# EAGLE schematic ESC_BOARD_NEW (EAGLE 8.5.0)
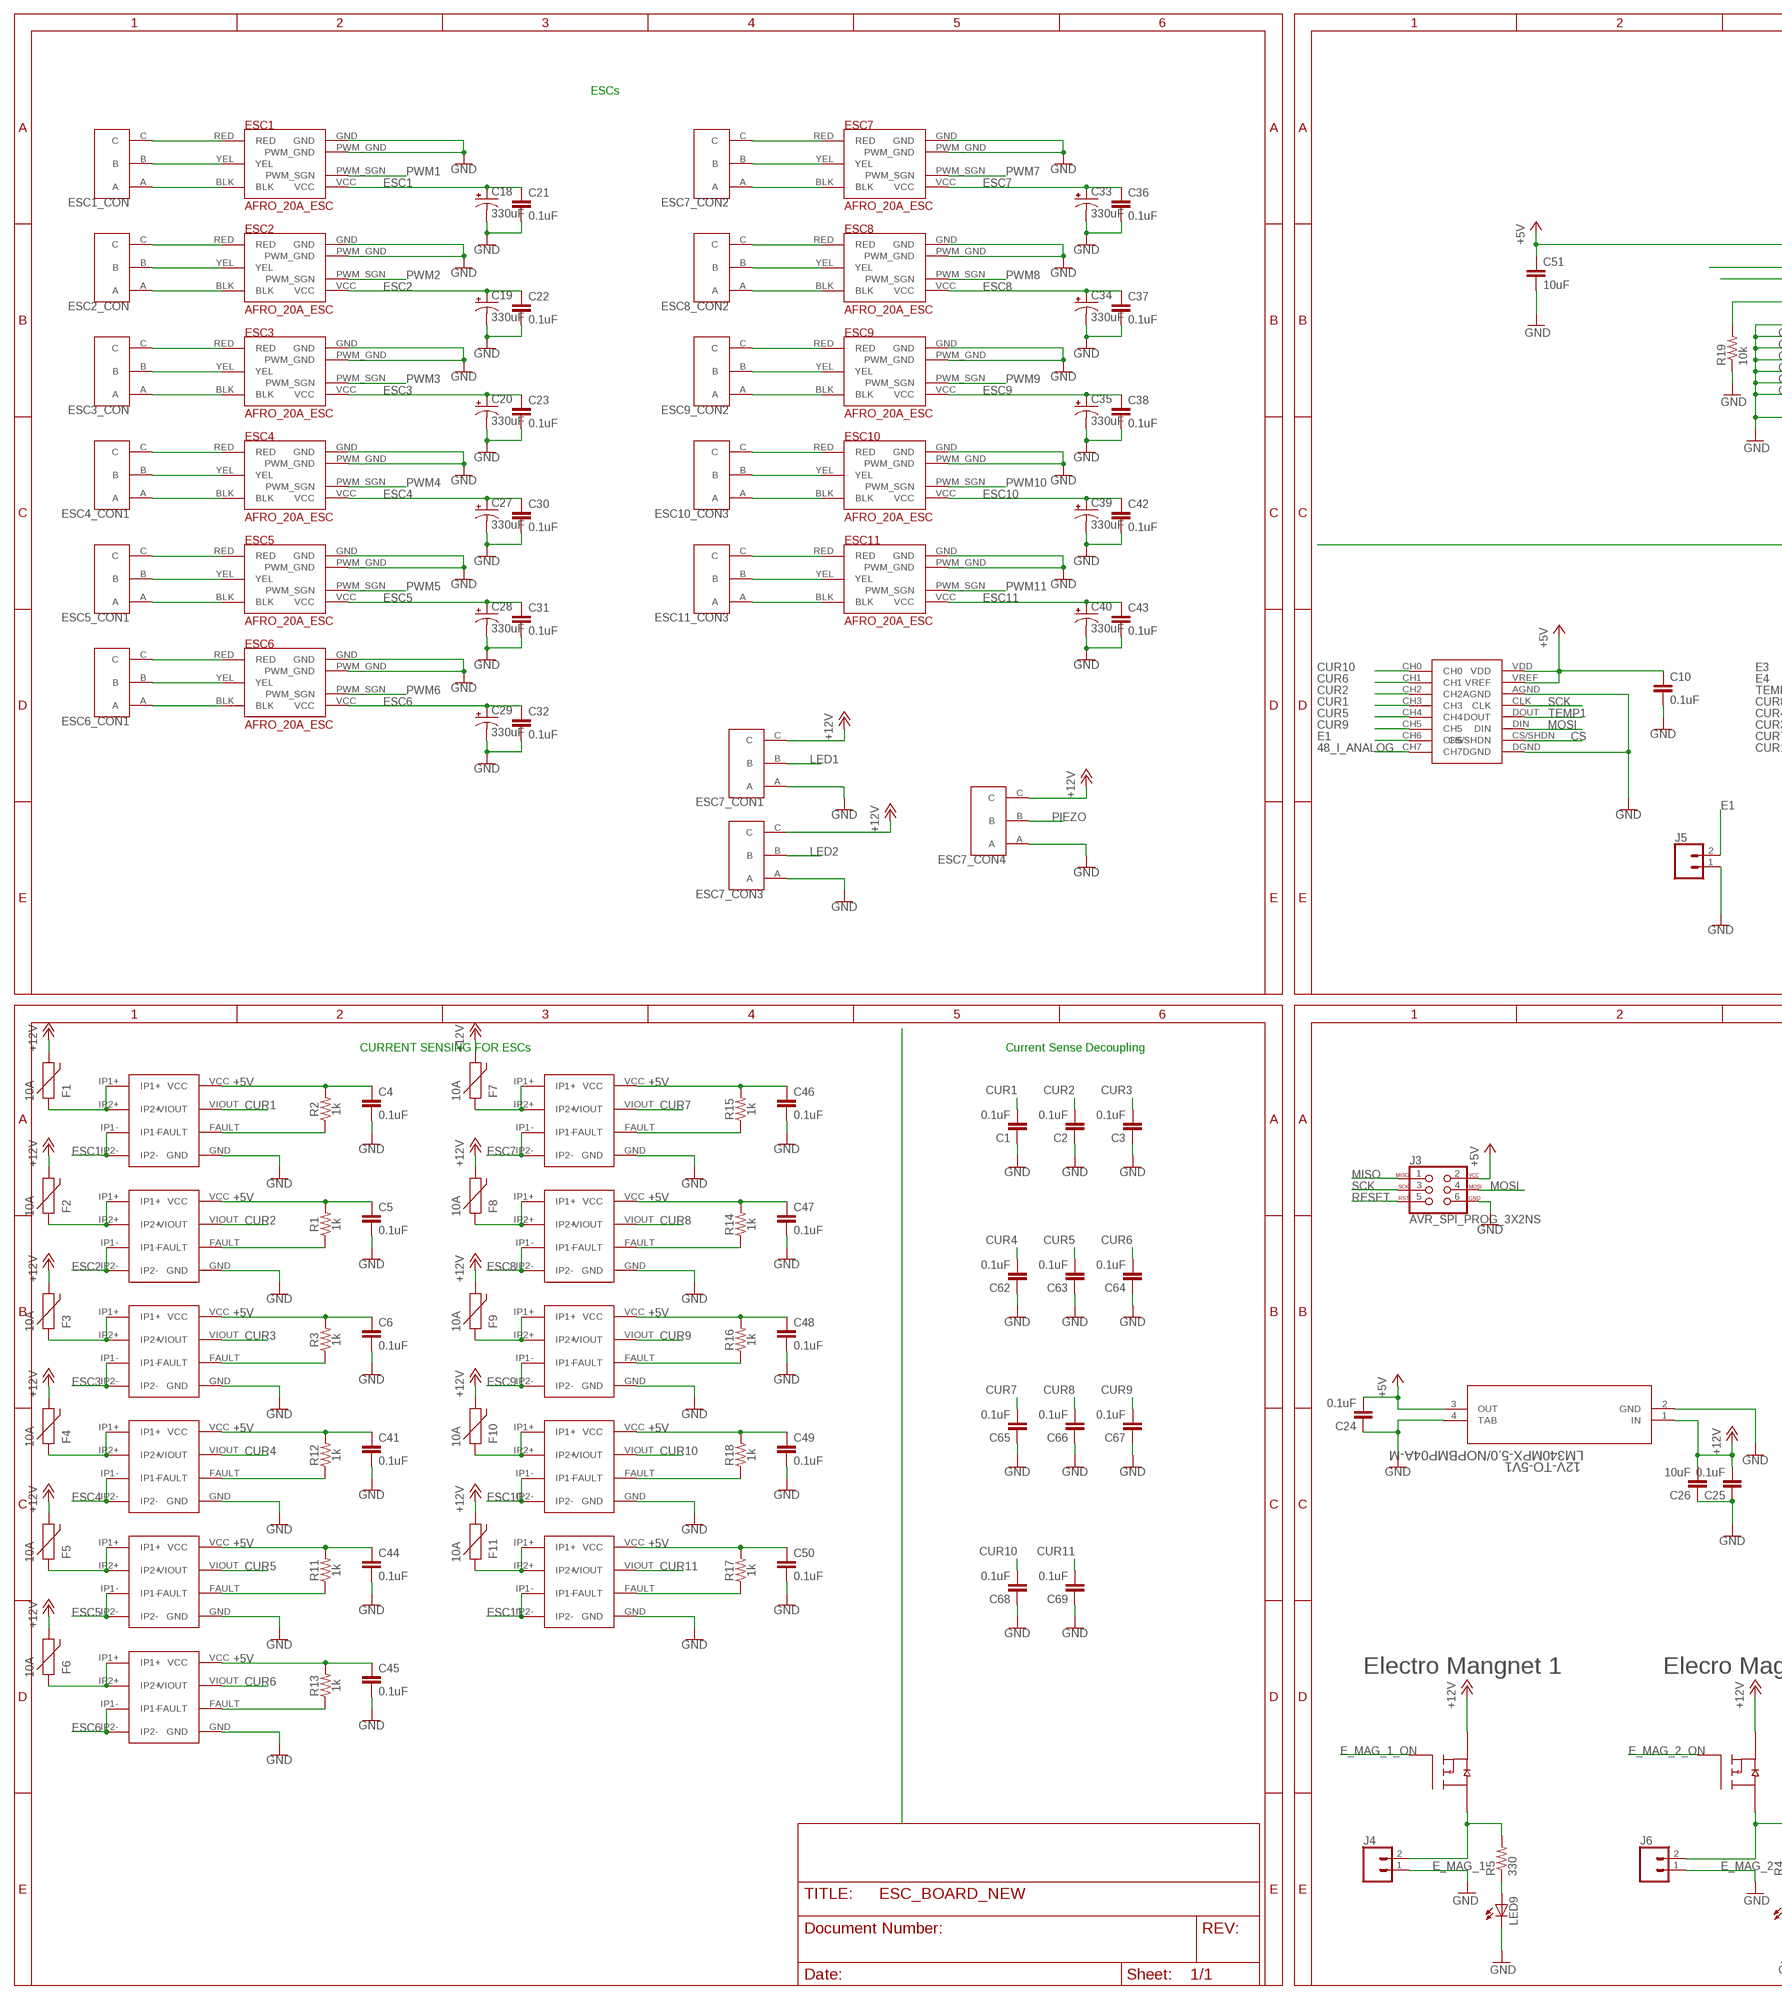
[diagram p0: schematic, sheet 1, part 1 of 2]
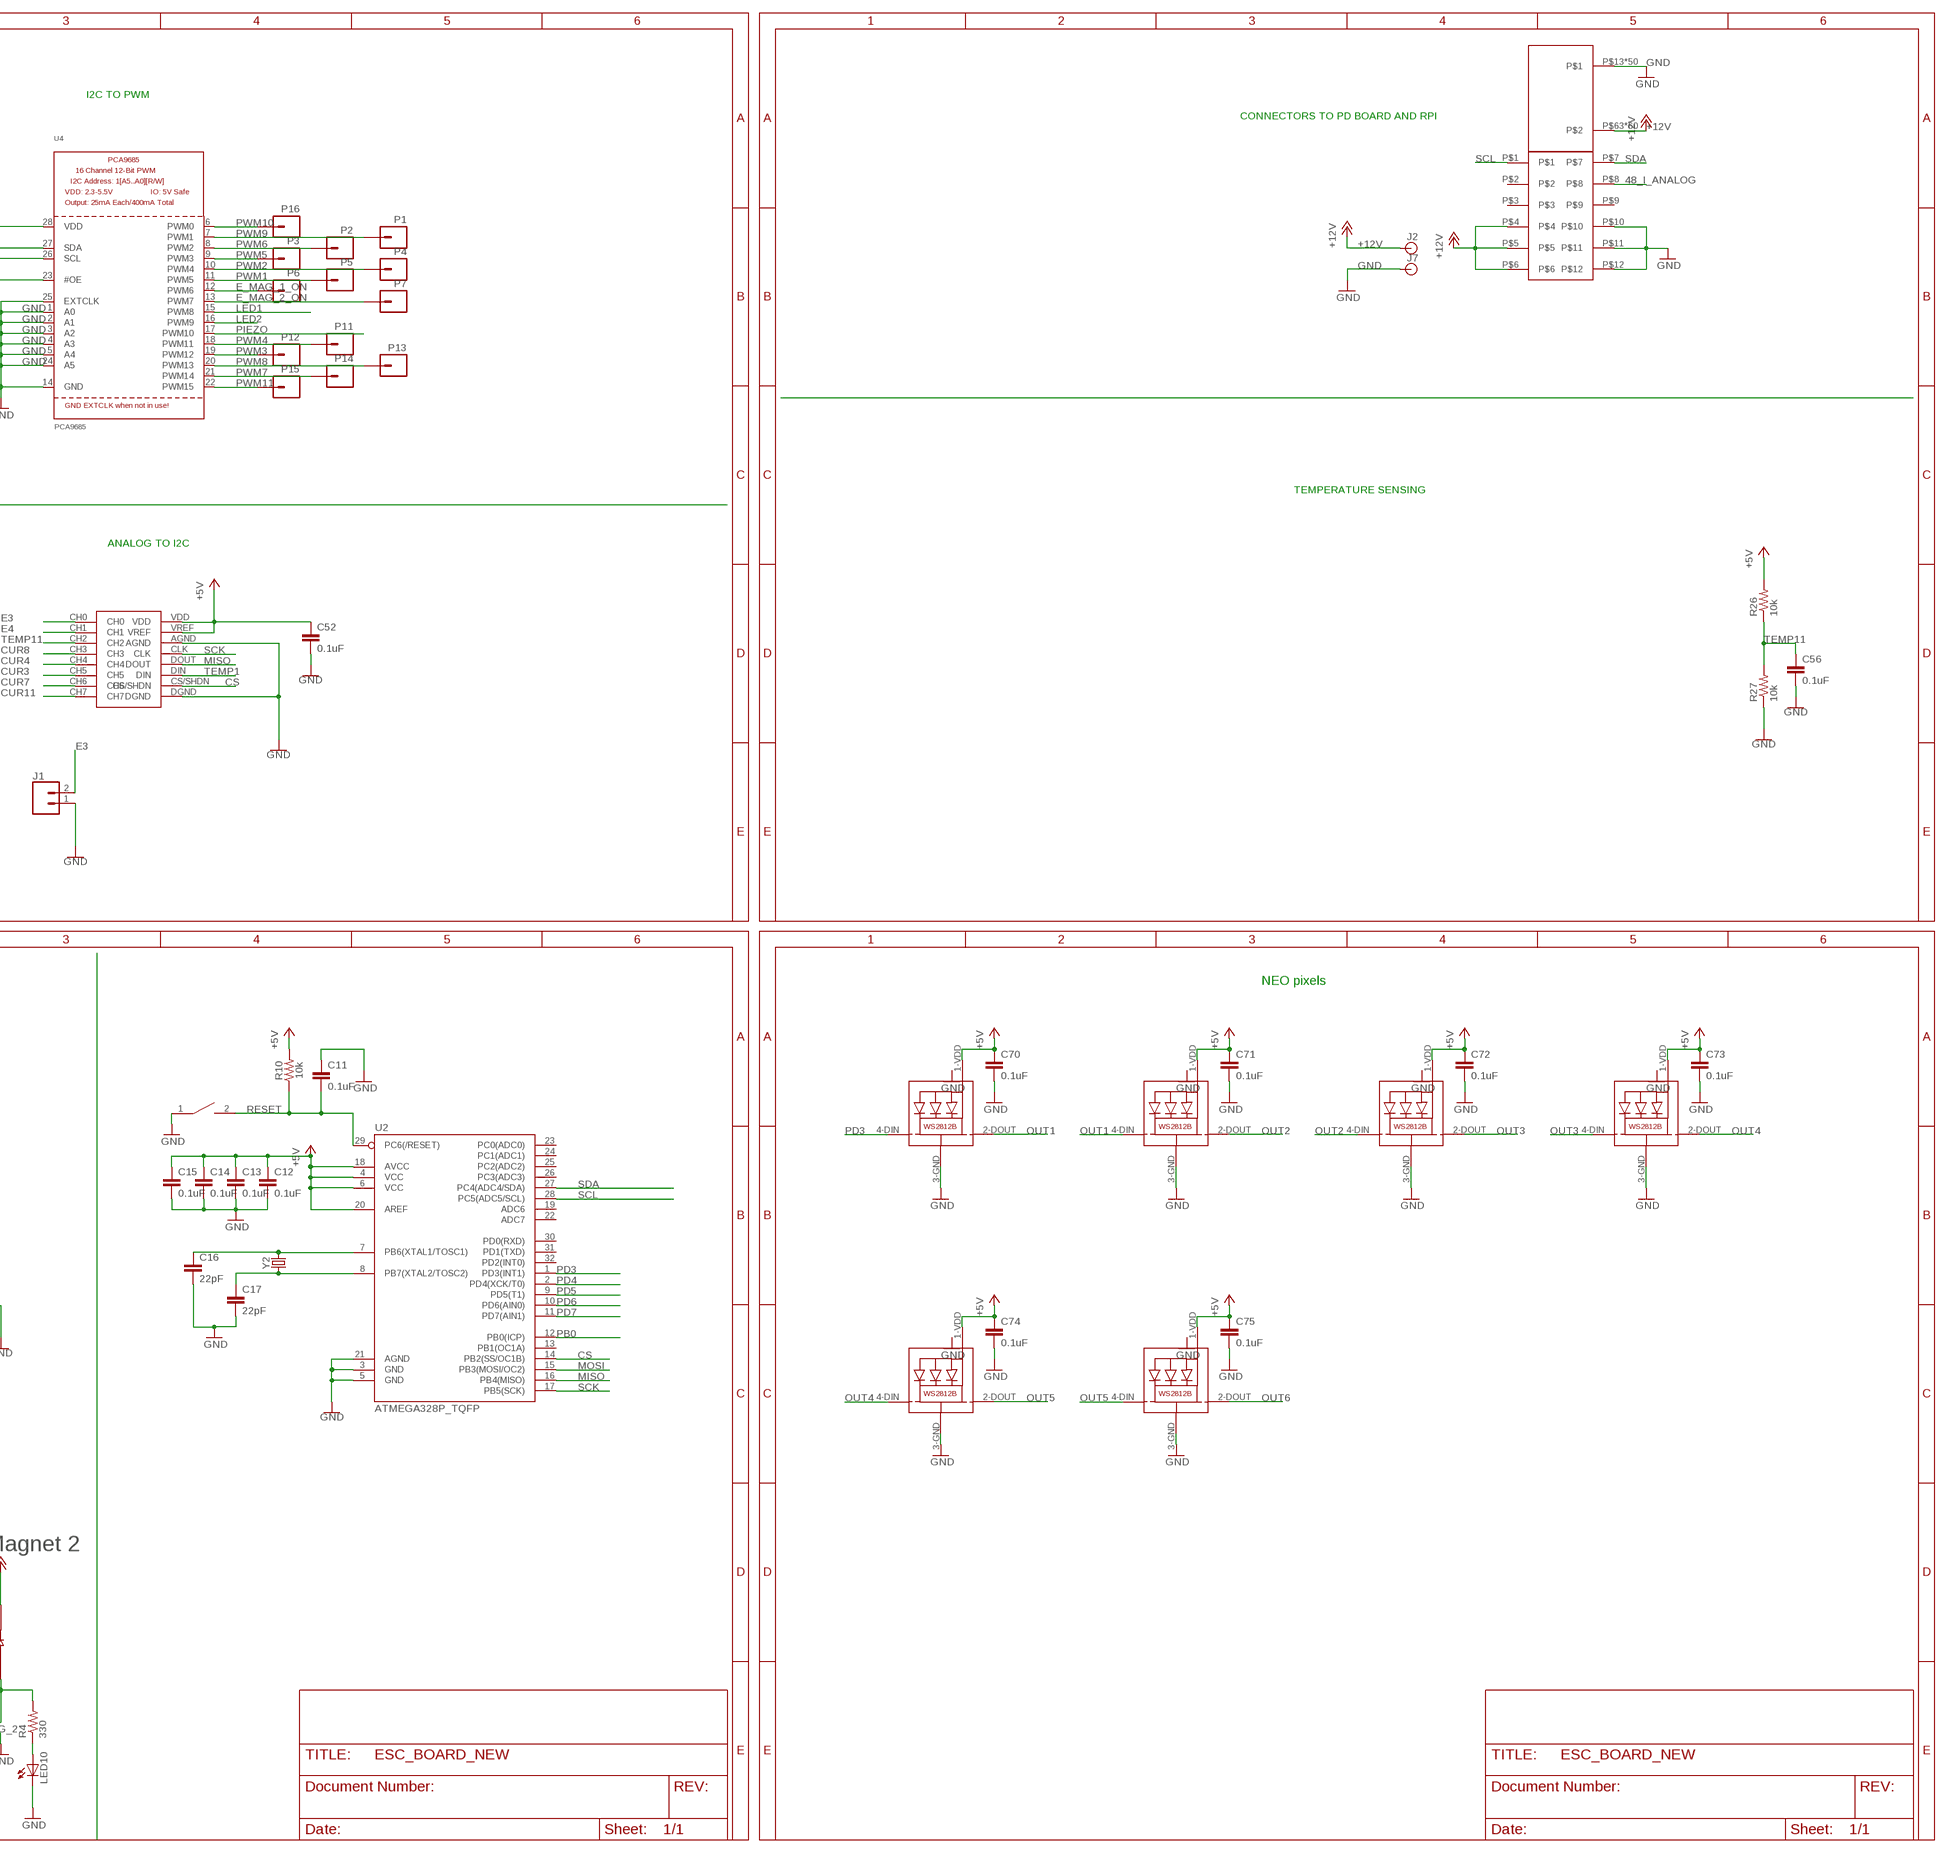
[diagram p1: schematic, sheet 1, part 2 of 2]

## Parts
12V-TO-5V1  LM340MPX-5.0/NOPBMP04A-M  [MP04A-M]
C1  0.1uF  0.1UF-0603-25V-(+80/-20%)  [0603]
C2  0.1uF  0.1UF-0603-25V-(+80/-20%)  [0603]
C3  0.1uF  0.1UF-0603-25V-(+80/-20%)  [0603]
C4  0.1uF  0.1UF-0603-25V-(+80/-20%)  [0603]
C5  0.1uF  0.1UF-0603-25V-(+80/-20%)  [0603]
C6  0.1uF  0.1UF-0603-25V-(+80/-20%)  [0603]
C10  0.1uF  0.1UF-0603-25V-(+80/-20%)  [0603]
C11  0.1uF  C-EUC0603  [C0603]
C12  0.1uF  C-EUC0603  [C0603]
C13  0.1uF  C-EUC0603  [C0603]
C14  0.1uF  C-EUC0603  [C0603]
C15  0.1uF  C-EUC0603  [C0603]
C16  22pF  C-EUC0603  [C0603]
C17  22pF  C-EUC0603  [C0603]
C18  330uF  C-ALUMINUM(330UF)  [CPOL-US(10.3_10.3MM)]
C19  330uF  C-ALUMINUM(330UF)  [CPOL-US(10.3_10.3MM)]
C20  330uF  C-ALUMINUM(330UF)  [CPOL-US(10.3_10.3MM)]
C21  0.1uF  0.1UF-0603-25V-(+80/-20%)  [0603]
C22  0.1uF  0.1UF-0603-25V-(+80/-20%)  [0603]
C23  0.1uF  0.1UF-0603-25V-(+80/-20%)  [0603]
C24  0.1uF  0.1UF-0603-25V-(+80/-20%)  [0603]
C25  0.1uF  0.1UF-0603-25V-(+80/-20%)  [0603]
C26  10uF  0.1UF-0603-25V-(+80/-20%)  [0603]
C27  330uF  C-ALUMINUM(330UF)  [CPOL-US(10.3_10.3MM)]
C28  330uF  C-ALUMINUM(330UF)  [CPOL-US(10.3_10.3MM)]
C29  330uF  C-ALUMINUM(330UF)  [CPOL-US(10.3_10.3MM)]
C30  0.1uF  0.1UF-0603-25V-(+80/-20%)  [0603]
C31  0.1uF  0.1UF-0603-25V-(+80/-20%)  [0603]
C32  0.1uF  0.1UF-0603-25V-(+80/-20%)  [0603]
C33  330uF  C-ALUMINUM(330UF)  [CPOL-US(10.3_10.3MM)]
C34  330uF  C-ALUMINUM(330UF)  [CPOL-US(10.3_10.3MM)]
C35  330uF  C-ALUMINUM(330UF)  [CPOL-US(10.3_10.3MM)]
C36  0.1uF  0.1UF-0603-25V-(+80/-20%)  [0603]
C37  0.1uF  0.1UF-0603-25V-(+80/-20%)  [0603]
C38  0.1uF  0.1UF-0603-25V-(+80/-20%)  [0603]
C39  330uF  C-ALUMINUM(330UF)  [CPOL-US(10.3_10.3MM)]
C40  330uF  C-ALUMINUM(330UF)  [CPOL-US(10.3_10.3MM)]
C41  0.1uF  0.1UF-0603-25V-(+80/-20%)  [0603]
C42  0.1uF  0.1UF-0603-25V-(+80/-20%)  [0603]
C43  0.1uF  0.1UF-0603-25V-(+80/-20%)  [0603]
C44  0.1uF  0.1UF-0603-25V-(+80/-20%)  [0603]
C45  0.1uF  0.1UF-0603-25V-(+80/-20%)  [0603]
C46  0.1uF  0.1UF-0603-25V-(+80/-20%)  [0603]
C47  0.1uF  0.1UF-0603-25V-(+80/-20%)  [0603]
C48  0.1uF  0.1UF-0603-25V-(+80/-20%)  [0603]
C49  0.1uF  0.1UF-0603-25V-(+80/-20%)  [0603]
C50  0.1uF  0.1UF-0603-25V-(+80/-20%)  [0603]
C51  10uF  0.1UF-25V(+80/-20%)(0603)  [0603-CAP]
C52  0.1uF  0.1UF-0603-25V-(+80/-20%)  [0603]
C56  0.1uF  0.1UF-0603-25V-(+80/-20%)  [0603]
C62  0.1uF  0.1UF-0603-25V-(+80/-20%)  [0603]
C63  0.1uF  0.1UF-0603-25V-(+80/-20%)  [0603]
C64  0.1uF  0.1UF-0603-25V-(+80/-20%)  [0603]
C65  0.1uF  0.1UF-0603-25V-(+80/-20%)  [0603]
C66  0.1uF  0.1UF-0603-25V-(+80/-20%)  [0603]
C67  0.1uF  0.1UF-0603-25V-(+80/-20%)  [0603]
C68  0.1uF  0.1UF-0603-25V-(+80/-20%)  [0603]
C69  0.1uF  0.1UF-0603-25V-(+80/-20%)  [0603]
C70  0.1uF  C-EUC0603  [C0603]
C71  0.1uF  C-EUC0603  [C0603]
C72  0.1uF  C-EUC0603  [C0603]
C73  0.1uF  C-EUC0603  [C0603]
C74  0.1uF  C-EUC0603  [C0603]
C75  0.1uF  C-EUC0603  [C0603]
ESC1  AFRO_20A_ESC  [AFRO_20A_ESC]
ESC1_CON  3PINCONNECTOR  [3PINCONNECTOR]
ESC2  AFRO_20A_ESC  [AFRO_20A_ESC]
ESC2_CON  3PINCONNECTOR  [3PINCONNECTOR]
ESC3  AFRO_20A_ESC  [AFRO_20A_ESC]
ESC3_CON  3PINCONNECTOR  [3PINCONNECTOR]
ESC4  AFRO_20A_ESC  [AFRO_20A_ESC]
ESC4_CON1  3PINCONNECTOR  [3PINCONNECTOR]
ESC5  AFRO_20A_ESC  [AFRO_20A_ESC]
ESC5_CON1  3PINCONNECTOR  [3PINCONNECTOR]
ESC6  AFRO_20A_ESC  [AFRO_20A_ESC]
ESC6_CON1  3PINCONNECTOR  [3PINCONNECTOR]
ESC7  AFRO_20A_ESC  [AFRO_20A_ESC]
ESC7_CON1  3PINCONNECTOR  [3PINCONNECTOR]
ESC7_CON2  3PINCONNECTOR  [3PINCONNECTOR]
ESC7_CON3  3PINCONNECTOR  [3PINCONNECTOR]
ESC7_CON4  3PINCONNECTOR  [3PINCONNECTOR]
ESC8  AFRO_20A_ESC  [AFRO_20A_ESC]
ESC8_CON2  3PINCONNECTOR  [3PINCONNECTOR]
ESC9  AFRO_20A_ESC  [AFRO_20A_ESC]
ESC9_CON2  3PINCONNECTOR  [3PINCONNECTOR]
ESC10  AFRO_20A_ESC  [AFRO_20A_ESC]
ESC10_CON3  3PINCONNECTOR  [3PINCONNECTOR]
ESC11  AFRO_20A_ESC  [AFRO_20A_ESC]
ESC11_CON3  3PINCONNECTOR  [3PINCONNECTOR]
F1  10A  PTC(2920L)  [PTC-2920]
F2  10A  PTC(2920L)  [PTC-2920]
F3  10A  PTC(2920L)  [PTC-2920]
F4  10A  PTC(2920L)  [PTC-2920]
F5  10A  PTC(2920L)  [PTC-2920]
F6  10A  PTC(2920L)  [PTC-2920]
F7  10A  PTC(2920L)  [PTC-2920]
F8  10A  PTC(2920L)  [PTC-2920]
F9  10A  PTC(2920L)  [PTC-2920]
F10  10A  PTC(2920L)  [PTC-2920]
F11  10A  PTC(2920L)  [PTC-2920]
J1  CONN_02  [1X02]
J2  BANANA_CONN  [BANANA_CONN]
J3  AVR_SPI_PROG_3X2NS  [2X3-NS]
J4  CONN_02  [1X02]
J5  CONN_02  [1X02]
J6  CONN_02  [1X02]
J7  BANANA_CONN  [BANANA_CONN]
LED1  WS2812B5050  [WS2812B]
LED2  WS2812B5050  [WS2812B]
LED3  WS2812B5050  [WS2812B]
LED4  WS2812B5050  [WS2812B]
LED5  WS2812B5050  [WS2812B]
LED6  WS2812B5050  [WS2812B]
LED9  LEDSML0603  [SML0603]
LED10  LEDSML0603  [SML0603]
P1  M01PTH  [1X01]
P2  M01PTH  [1X01]
P3  M01PTH  [1X01]
P4  M01PTH  [1X01]
P5  M01PTH  [1X01]
P6  M01PTH  [1X01]
P7  M01PTH  [1X01]
P11  M01PTH  [1X01]
P12  M01PTH  [1X01]
P13  M01PTH  [1X01]
P14  M01PTH  [1X01]
P15  M01PTH  [1X01]
P16  M01PTH  [1X01]
R1  1k  1KOHM-0603-1/10W-1%  [0603]
R2  1k  1KOHM-0603-1/10W-1%  [0603]
R3  1k  1KOHM-0603-1/10W-1%  [0603]
R4  330  R-US_R0603  [R0603]
R5  330  R-US_R0603  [R0603]
R10  10k  RESISTOR0603  [0603]
R11  1k  1KOHM-0603-1/10W-1%  [0603]
R12  1k  1KOHM-0603-1/10W-1%  [0603]
R13  1k  1KOHM-0603-1/10W-1%  [0603]
R14  1k  1KOHM-0603-1/10W-1%  [0603]
R15  1k  1KOHM-0603-1/10W-1%  [0603]
R16  1k  1KOHM-0603-1/10W-1%  [0603]
R17  1k  1KOHM-0603-1/10W-1%  [0603]
R18  1k  1KOHM-0603-1/10W-1%  [0603]
R19  10k  470OHM1/10W1%(0603)  [0603-RES]
R26  10k  R-US_R0603  [R0603]
R27  10k  R-US_R0603  [R0603]
RESET  SWITCH  [SW_2512]
U1  FQB27P06  [TO263-3]
U2  ATMEGA328P_TQFP  [TQFP32-08]
U3  FQB27P06  [TO263-3]
U4  PCA9685  [TSSOP28]
U$1  ACS711  [ACS711]
U$2  ACS711  [ACS711]
U$3  ACS711  [ACS711]
U$4  MCP3008  [MCP3008]
U$5  ACS711  [ACS711]
U$6  ACS711  [ACS711]
U$7  ACS711  [ACS711]
U$8  ACS711  [ACS711]
U$9  ACS711  [ACS711]
U$10  ACS711  [ACS711]
U$11  ACS711  [ACS711]
U$12  ACS711  [ACS711]
U$13  MCP3008  [MCP3008]
U$15  ESC-FULL  [ESC-FULL]
Y2  CRYSTALPTH-HC49US  [HC49US]

## Nets
48_I_ANALOG: U$4.CH7 U$15.P$8
+5V: 12V-TO-5V1.3(OUT) C4.1 C5.1 C6.1 C10.1 C12.1 C13.1 C14.1 C15.1 C24.2 C41.1 C44.1 C45.1 C46.1 C47.1 C48.1 C49.1 C50.1 C51.1 C52.1 C70.1 C71.1 C72.1 C73.1 C74.1 C75.1 J3.2 LED1.1-VDD(VDD) LED2.1-VDD(VDD) LED3.1-VDD(VDD) LED4.1-VDD(VDD) LED5.1-VDD(VDD) LED6.1-VDD(VDD) R1.2 R2.2 R3.2 R10.2 R11.2 R12.2 R13.2 R14.2 R15.2 R16.2 R17.2 R18.2 R26.2 U2.4(VCC) U2.6(VCC) U2.18(AVCC) U2.20(AREF) U4.28(VDD) U$1.VCC U$2.VCC U$3.VCC U$4.VDD U$4.VREF U$5.VCC U$6.VCC U$7.VCC U$8.VCC U$9.VCC U$10.VCC U$11.VCC U$12.VCC U$13.VDD U$13.VREF
+12V: 12V-TO-5V1.1(IN) C25.2 C26.2 ESC7_CON1.C ESC7_CON3.C ESC7_CON4.C F1.2 F2.2 F3.2 F4.2 F5.2 F6.2 F7.2 F8.2 F9.2 F10.2 F11.2 J2.P$1 U1.3(S2) U3.3(S2) U$15.P$4 U$15.P$5 U$15.P$6 U$15.P$63 U$15.P$64 U$15.P$65 U$15.P$66 U$15.P$67 U$15.P$68 U$15.P$69 U$15.P$70 U$15.P$71 U$15.P$72 U$15.P$73 U$15.P$74 U$15.P$75 U$15.P$76 U$15.P$77 U$15.P$78 U$15.P$79 U$15.P$80 U$15.P$81 U$15.P$82 U$15.P$83 U$15.P$84 U$15.P$85 U$15.P$86 U$15.P$87 U$15.P$88 U$15.P$89 U$15.P$90 U$15.P$91 U$15.P$92 U$15.P$101 U$15.P$102 U$15.P$103 U$15.P$104 U$15.P$105 U$15.P$106 U$15.P$107 U$15.P$108 U$15.P$109 U$15.P$110 U$15.P$111 U$15.P$112 U$15.P$113 U$15.P$114 U$15.P$115 U$15.P$116 U$15.P$117 U$15.P$118 U$15.P$119 U$15.P$120 U$15.P$121 U$15.P$122 U$15.P$123 U$15.P$124 U$15.P$125 U$15.P$126 U$15.P$127 U$15.P$128 U$15.P$129 U$15.P$130
CS: U2.14(PB2(SS/OC1B)) U$4.CS/SHDN U$13.CS/SHDN
CUR1: C1.2 U$1.VIOUT U$4.CH3
CUR2: C2.2 U$2.VIOUT U$4.CH2
CUR3: C3.2 U$3.VIOUT U$13.CH5
CUR4: C62.2 U$5.VIOUT U$13.CH4
CUR5: C63.2 U$4.CH4 U$6.VIOUT
CUR6: C64.2 U$4.CH1 U$7.VIOUT
CUR7: C65.2 U$8.VIOUT U$13.CH6
CUR8: C66.2 U$9.VIOUT U$13.CH3
CUR9: C67.2 U$4.CH5 U$10.VIOUT
CUR10: C68.2 U$4.CH0 U$11.VIOUT
CUR11: C69.2 U$12.VIOUT U$13.CH7
E1: J5.2 U$4.CH6
E3: J1.2 U$13.CH0
E4: U$13.CH1
E_MAG_1: J4.2 R5.2 U1.TAB(D2)
E_MAG_1_ON: P6.1 U1.1(G2) U4.12(PWM6)
E_MAG_2: J6.2 R4.2 U3.TAB(D2)
E_MAG_2_ON: P7.1 U3.1(G2) U4.13(PWM7)
ESC1: C18.+ C21.1 ESC1.VCC U$1.IP1- U$1.IP2-
ESC2: C19.+ C22.1 ESC2.VCC U$2.IP1- U$2.IP2-
ESC3: C20.+ C23.1 ESC3.VCC U$3.IP1- U$3.IP2-
ESC4: C27.+ C30.1 ESC4.VCC U$5.IP1- U$5.IP2-
ESC5: C28.+ C31.1 ESC5.VCC U$6.IP1- U$6.IP2-
ESC6: C29.+ C32.1 ESC6.VCC U$7.IP1- U$7.IP2-
ESC7: C33.+ C36.1 ESC7.VCC U$8.IP1- U$8.IP2-
ESC8: C34.+ C37.1 ESC8.VCC U$9.IP1- U$9.IP2-
ESC9: C35.+ C38.1 ESC9.VCC U$10.IP1- U$10.IP2-
ESC10: C39.+ C42.1 ESC10.VCC U$11.IP1- U$11.IP2-
ESC11: C40.+ C43.1 ESC11.VCC U$12.IP1- U$12.IP2-
GND: 12V-TO-5V1.2(GND) 12V-TO-5V1.4(TAB) C1.1 C2.1 C3.1 C4.2 C5.2 C6.2 C10.2 C11.1 C12.2 C13.2 C14.2 C15.2 C16.2 C17.2 C18.- C19.- C20.- C21.2 C22.2 C23.2 C24.1 C25.1 C26.1 C27.- C28.- C29.- C30.2 C31.2 C32.2 C33.- C34.- C35.- C36.2 C37.2 C38.2 C39.- C40.- C41.2 C42.2 C43.2 C44.2 C45.2 C46.2 C47.2 C48.2 C49.2 C50.2 C51.2 C52.2 C56.2 C62.1 C63.1 C64.1 C65.1 C66.1 C67.1 C68.1 C69.1 C70.2 C71.2 C72.2 C73.2 C74.2 C75.2 ESC1.GND ESC1.PWM_GND ESC2.GND ESC2.PWM_GND ESC3.GND ESC3.PWM_GND ESC4.GND ESC4.PWM_GND ESC5.GND ESC5.PWM_GND ESC6.GND ESC6.PWM_GND ESC7.GND ESC7.PWM_GND ESC7_CON1.A ESC7_CON3.A ESC7_CON4.A ESC8.GND ESC8.PWM_GND ESC9.GND ESC9.PWM_GND ESC10.GND ESC10.PWM_GND ESC11.GND ESC11.PWM_GND J1.1 J3.6 J4.1 J5.1 J6.1 J7.P$1 LED1.3-GND(GND) LED2.3-GND(GND) LED3.3-GND(GND) LED4.3-GND(GND) LED5.3-GND(GND) LED6.3-GND(GND) LED9.C LED10.C R19.1 R27.1 RESET.1 U2.3(GND) U2.5(GND) U2.21(AGND) U4.1(A0) U4.2(A1) U4.3(A2) U4.4(A3) U4.5(A4) U4.14(GND) U4.24(A5) U4.25(EXTCLK) U$1.GND U$2.GND U$3.GND U$4.AGND U$4.DGND U$5.GND U$6.GND U$7.GND U$8.GND U$9.GND U$10.GND U$11.GND U$12.GND U$13.AGND U$13.DGND U$15.P$10 U$15.P$11 U$15.P$12 U$15.P$13 U$15.P$14 U$15.P$15 U$15.P$16 U$15.P$17 U$15.P$18 U$15.P$19 U$15.P$20 U$15.P$21 U$15.P$22 U$15.P$23 U$15.P$24 U$15.P$25 U$15.P$26 U$15.P$27 U$15.P$28 U$15.P$29 U$15.P$30 U$15.P$31 U$15.P$32 U$15.P$33 U$15.P$34 U$15.P$35 U$15.P$36 U$15.P$37 U$15.P$38 U$15.P$39 U$15.P$40 U$15.P$41 U$15.P$42 U$15.P$43 U$15.P$44 U$15.P$45 U$15.P$46 U$15.P$47 U$15.P$48 U$15.P$49 U$15.P$50 U$15.P$51 U$15.P$52 U$15.P$53 U$15.P$54 U$15.P$55 U$15.P$56 U$15.P$57 U$15.P$58 U$15.P$59 U$15.P$60 U$15.P$61 U$15.P$62
LED1: ESC7_CON1.B U4.15(PWM8)
LED2: ESC7_CON3.B U4.16(PWM9)
MISO: J3.1 U2.16(PB4(MISO)) U$13.DOUT
MOSI: J3.4 U2.15(PB3(MOSI/OC2)) U$4.DIN
N$1: ESC2.RED ESC2_CON.C
N$2: R2.1 U$1.FAULT
N$3: ESC2.YEL ESC2_CON.B
N$4: R1.1 U$2.FAULT
N$5: ESC2.BLK ESC2_CON.A
N$6: R3.1 U$3.FAULT
N$7: ESC1.RED ESC1_CON.C
N$8: ESC1.YEL ESC1_CON.B
N$9: ESC1.BLK ESC1_CON.A
N$10: ESC3.RED ESC3_CON.C
N$11: ESC3.YEL ESC3_CON.B
N$12: ESC3.BLK ESC3_CON.A
N$13: R12.1 U$5.FAULT
N$14: C16.1 U2.7(PB6(XTAL1/TOSC1)) Y2.2
N$15: C17.1 U2.8(PB7(XTAL2/TOSC2)) Y2.1
N$16: ESC5.RED ESC5_CON1.C
N$17: ESC5.YEL ESC5_CON1.B
N$18: ESC5.BLK ESC5_CON1.A
N$19: ESC4.RED ESC4_CON1.C
N$20: ESC4.YEL ESC4_CON1.B
N$21: ESC4.BLK ESC4_CON1.A
N$22: ESC6.RED ESC6_CON1.C
N$23: ESC6.YEL ESC6_CON1.B
N$24: ESC6.BLK ESC6_CON1.A
N$25: ESC8.RED ESC8_CON2.C
N$26: ESC8.YEL ESC8_CON2.B
N$27: ESC8.BLK ESC8_CON2.A
N$28: ESC7.RED ESC7_CON2.C
N$29: ESC7.YEL ESC7_CON2.B
N$30: ESC7.BLK ESC7_CON2.A
N$31: ESC9.RED ESC9_CON2.C
N$32: ESC9.YEL ESC9_CON2.B
N$33: ESC9.BLK ESC9_CON2.A
N$34: ESC11.RED ESC11_CON3.C
N$35: ESC11.YEL ESC11_CON3.B
N$36: ESC11.BLK ESC11_CON3.A
N$37: ESC10.RED ESC10_CON3.C
N$38: ESC10.YEL ESC10_CON3.B
N$39: ESC10.BLK ESC10_CON3.A
N$40: R11.1 U$6.FAULT
N$41: R13.1 U$7.FAULT
N$42: R15.1 U$8.FAULT
N$43: R14.1 U$9.FAULT
N$44: R16.1 U$10.FAULT
N$45: R18.1 U$11.FAULT
N$46: R17.1 U$12.FAULT
N$51: LED9.A R5.1
N$52: F6.1 U$7.IP1+ U$7.IP2+
N$53: F1.1 U$1.IP1+ U$1.IP2+
N$54: F2.1 U$2.IP1+ U$2.IP2+
N$55: F3.1 U$3.IP1+ U$3.IP2+
N$56: F4.1 U$5.IP1+ U$5.IP2+
N$57: F5.1 U$6.IP1+ U$6.IP2+
N$58: F7.1 U$8.IP1+ U$8.IP2+
N$59: R19.2 U4.23(#OE)
N$60: F8.1 U$9.IP1+ U$9.IP2+
N$61: F9.1 U$10.IP1+ U$10.IP2+
N$62: F10.1 U$11.IP1+ U$11.IP2+
N$63: F11.1 U$12.IP1+ U$12.IP2+
N$64: LED10.A R4.1
OUT1: LED1.2-DOUT(DO) LED2.4-DIN(DI)
OUT2: LED2.2-DOUT(DO) LED3.4-DIN(DI)
OUT3: LED3.2-DOUT(DO) LED4.4-DIN(DI)
OUT4: LED4.2-DOUT(DO) LED5.4-DIN(DI)
OUT5: LED5.2-DOUT(DO) LED6.4-DIN(DI)
OUT6: LED6.2-DOUT(DO)
PB0: U2.12(PB0(ICP))
PD3: LED1.4-DIN(DI) U2.1(PD3(INT1))
PD4: U2.2(PD4(XCK/T0))
PD5: U2.9(PD5(T1))
PD6: U2.10(PD6(AIN0))
PD7: U2.11(PD7(AIN1))
PIEZO: ESC7_CON4.B U4.17(PWM10)
PWM1: ESC1.PWM_SGN P5.1 U4.11(PWM5)
PWM2: ESC2.PWM_SGN P4.1 U4.10(PWM4)
PWM3: ESC3.PWM_SGN P12.1 U4.19(PWM12)
PWM4: ESC4.PWM_SGN P11.1 U4.18(PWM11)
PWM5: ESC5.PWM_SGN P3.1 U4.9(PWM3)
PWM6: ESC6.PWM_SGN P2.1 U4.8(PWM2)
PWM7: ESC7.PWM_SGN P14.1 U4.21(PWM14)
PWM8: ESC8.PWM_SGN P13.1 U4.20(PWM13)
PWM9: ESC9.PWM_SGN P1.1 U4.7(PWM1)
PWM10: ESC10.PWM_SGN P16.1 U4.6(PWM0)
PWM11: ESC11.PWM_SGN P15.1 U4.22(PWM15)
RESET: C11.2 J3.5 R10.1 RESET.2 U2.29(PC6(/RESET))
SCK: J3.3 U2.17(PB5(SCK)) U$4.CLK U$13.CLK
SCL: U2.28(PC5(ADC5/SCL)) U4.26(SCL) U$15.P$1
SDA: U2.27(PC4(ADC4/SDA)) U4.27(SDA) U$15.P$7
TEMP1: U$4.DOUT U$13.DIN
TEMP11: C56.1 R26.1 R27.2 U$13.CH2
Unconnected: U2.13(PB1(OC1A)) U2.19(ADC6) U2.22(ADC7) U2.23(PC0(ADC0)) U2.24(PC1(ADC1)) U2.25(PC2(ADC2)) U2.26(PC3(ADC3)) U2.30(PD0(RXD)) U2.31(PD1(TXD)) U2.32(PD2(INT0)) U$15.P$2 U$15.P$3 U$15.P$9

## Notes on the sheet
- ESCs
- I2C TO PWM
- CONNECTORS TO PD BOARD AND RPI
- TEMPERATURE SENSING
- ANALOG TO I2C
- CURRENT SENSING FOR ESCs | Current Sense Decoupling
- NEO pixels
- Electro Mangnet 1 | Elecro Magnet 2

## Library data of the parts
12V-TO-5V1 = 12v_to_5v_linreg:LM340MPX-5.0/NOPB; MANUFACTURER_PART_NUMBER: LM340MPX5.0NOPB; VENDOR: National Semiconductor
C1-C6 C10 C21-C25 C30-C32 C36-C38 C41-C50 C52 C56 C62-C69 = SparkFun-Capacitors:0.1UF: 0.1µF ceramic capacitors A capacitor is a passive two-terminal electrical component used to store electrical energy temporarily in an electric field.; PROD_ID: CAP-00810
C11-C17 C70-C75 = rcl:C-EU: CAPACITOR, European symbol
C18-C20 C27-C29 C33-C35 C39 C40 = PowerComponents:C-ALUMINUM(330UF)
C26 = SparkFun-Capacitors:0.1UF: 0.1µF ceramic capacitors A capacitor is a passive two-terminal electrical component used to store electrical energy temporarily in an electric field.; PROD_ID: CAP-00810; VALUE: 0.1uF
C51 = SparkFun-Capacitors:0.1UF-25V(+80/-20%)(0603): CAP-00810 Ceramic Standard decoupling cap; PROD_ID: CAP-00810; VALUE: 0.1uF
ESC1-ESC11 = afro_20A_esc:AFRO_20A_ESC
ESC1_CON ESC2_CON ESC3_CON ESC4_CON1 ESC5_CON1 ESC6_CON1 ESC7_CON1-ESC7_CON4 ESC8_CON2 ESC9_CON2 ESC10_CON3 ESC11_CON3 = afro_20A_esc:3PINCONNECTOR
F1-F11 = PowerComponents:PTC(2920L)
J1 J4-J6 = SparkFun-Connectors:CONN_02: Multi connection point. Often used as Generic Header-pin footprint for 0.1 inch spaced/style header connections On any of the 0.1 inch spaced packages, you can populate with these: Break Away Headers - Straight <https://www.sparkfun.com/products/116> (PRT-00116) Break Away Male Headers - Right Angle <https://www.sparkfun.com/products/553> (PRT-00553) Female Headers <https://www.sparkfun.com/products/115> (PRT-00115) Break Away Headers - Machine Pin <https://www.sparkfun.com/products/117> (PRT-00117) Break Away Female Headers - Swiss Machine Pin <https://www.sparkfun.com/products/743> (PRT-00743) For SCREWTERMINALS and SPRING TERMINALS visit here: Screw Terimnals on SparkFun.com <https://www.sparkfun.com/search/results?term=Screw+Terminals> (5mm/3.5mm/2.54mm spacing) This device is also useful as a general connection point to wire up your design to another part of your project. Our various solder wires solder well into these plated through hole pads. Hook-Up Wire - Assortment (Stranded, 22 AWG) <https://www.sparkfun.com/products/11375> (PRT-11375) Hook-Up Wire - Assortment (Solid Core, 22 AWG) <https://www.sparkfun.com/products/11367> (PRT-11367) View the entire wire category on our website here <https://www.sparkfun.com/categories/141> Special notes: Molex polarized connector foot print use with: PRT-08233 with associated crimp pins and housings. 2.54_SCREWTERM for use with PRT-10571. 3.5mm Screw Terminal footprints for PRT-08084 5mm Screw Terminal footprints for use with PRT-08432
J2 J7 = SparkFun-Connectors:BANANA_CONN: Through-hole Banana Jack Basic PTH connection for banana jack plugs SparkFun Products: Multimeter Kit <https://www.sparkfun.com/products/retired/10956> Banana to Alligator Cable <https://www.sparkfun.com/products/retired/509> Banana to Alligator Coax Cable <https://www.sparkfun.com/products/retired/508> Banana to Banana Cable <https://www.sparkfun.com/products/retired/507> Banana to IC Hook Cables <https://www.sparkfun.com/products/retired/506>
J3 = SparkFun-Connectors:AVR_SPI_PROG_3X2: AVR ISP 6 Pin This is the reduced ISP connector for AVR programming. Common on Arduino. This footprint will take up less PCB space and can be used with a 10-pin to 6-pin adapter such as SKU: BOB-08508 **Special note about "TEST_POINT" package. The stop mask is on the top side, so if you want your programming test points to be on the bottom of your board, make sure to place this package on the bottom side of the board. This also ensure that the orientation to program from the bottom side will be correct. SparkFun Products: SparkFun ISP Pogo Adapter <https://www.sparkfun.com/products/11591> - NS Tiny AVR Programmer <https://www.sparkfun.com/products/11801> -PTH
LED1-LED6 = microbuilder:WS2812B5050
LED9 LED10 = led:LED: LED OSRAM: - CHIPLED LG R971, LG N971, LY N971, LG Q971, LY Q971, LO R971, LY R971 LH N974, LH R974 LS Q976, LO Q976, LY Q976 LO Q996 - Hyper CHIPLED LW Q18S LB Q993, LB Q99A, LB R99A - SideLED LS A670, LO A670, LY A670, LG A670, LP A670 LB A673, LV A673, LT A673, LW A673 LH A674 LY A675 LS A676, LA A676, LO A676, LY A676, LW A676 LS A679, LY A679, LG A679 - Hyper Micro SIDELED® LS Y876, LA Y876, LO Y876, LY Y876 LT Y87S - SmartLED LW L88C, LW L88S LB L89C, LB L89S, LG L890 LS L89K, LO L89K, LY L89K LS L896, LA L896, LO L896, LY L896 - TOPLED LS T670, LO T670, LY T670, LG T670, LP T670 LSG T670, LSP T670, LSY T670, LOP T670, LYG T670 LG T671, LOG T671, LSG T671 LB T673, LV T673, LT T673, LW T673 LH T674 LS T676, LA T676, LO T676, LY T676, LB T676, LH T676, LSB T676, LW T676 LB T67C, LV T67C, LT T67C, LS T67K, LO T67K, LY T67K, LW E67C LS E67B, LA E67B, LO E67B, LY E67B, LB E67C, LV E67C, LT E67C LW T67C LS T679, LY T679, LG T679 LS T770, LO T770, LY T770, LG T770, LP T770 LB T773, LV T773, LT T773, LW T773 LH T774 LS E675, LA E675, LY E675, LS T675 LS T776, LA T776, LO T776, LY T776, LB T776 LHGB T686 LT T68C, LB T68C - Hyper Mini TOPLED® LB M676 - Mini TOPLED Santana® LG M470 LS M47K, LO M47K, LY M47K Source: http://www.osram.convergy.de LUXEON: - LUMILED® LXK2-PW12-R00, LXK2-PW12-S00, LXK2-PW14-U00, LXK2-PW14-V00 LXK2-PM12-R00, LXK2-PM12-S00, LXK2-PM14-U00 LXK2-PE12-Q00, LXK2-PE12-R00, LXK2-PE12-S00, LXK2-PE14-T00, LXK2-PE14-U00 LXK2-PB12-K00, LXK2-PB12-L00, LXK2-PB12-M00, LXK2-PB14-N00, LXK2-PB14-P00, LXK2-PB14-Q00 LXK2-PR12-L00, LXK2-PR12-M00, LXK2-PR14-Q00, LXK2-PR14-R00 LXK2-PD12-Q00, LXK2-PD12-R00, LXK2-PD12-S00 LXK2-PH12-R00, LXK2-PH12-S00 LXK2-PL12-P00, LXK2-PL12-Q00, LXK2-PL12-R00 Source: www.luxeon.com KINGBRIGHT: KA-3528ASYC Source: www.kingbright.com
P1-P7 P11-P16 = SparkFun-Connectors:M01: Header 1 Standard 1-pin 0.1" header. Use with straight break away headers (SKU : PRT-00116), right angle break away headers (PRT-00553), swiss pins (PRT-00743), machine pins (PRT-00117), and female headers (PRT-00115). SMTSO-256-ET is a "flush mount" nut for a 4-40 screw. The older package used to be too tight, and did not allow it to sit properly thru the drill hit. The latest (0.165DIA) fits nice and snug.
R1-R3 R11-R18 = SparkFun-Resistors:1KOHM: 1kΩ resistor A resistor is a passive two-terminal electrical component that implements electrical resistance as a circuit element. Resistors act to reduce current flow, and, at the same time, act to lower voltage levels within circuits. - Wikipedia; PROD_ID: RES-07856
R4 R5 = resistor:R-US_: RESISTOR, American symbol
R10 = SparkFun-Resistors:RESISTOR: Generic Resistor Package
R19 = SparkFun-Resistors:470OHM1/10W1%(0603): RES-07869; PROD_ID: RES-07869; VALUE: 470
R26 R27 = rcl:R-US_: RESISTOR, American symbol
RESET = DiscreteComponents:SWITCH
U1 U3 = CamSensComponents:FQB27P06
U2 = SparkFun-IC-Microcontroller:ATMEGA328P_TQFP: Popular 328P in QFP Storefront component: ATmega328 - TQFP <https://www.sparkfun.com/products/13448> (COM-13448) Datasheet <http://www.sparkfun.com/datasheets/Components/SMD/ATMega328.pdf> SparkFun Products SparkFun RedBoard - Programmed with Arduino <https://www.sparkfun.com/products/12757> (DEV-12757) Arduino Pro Mini 328 - 5V/16MHz <https://www.sparkfun.com/products/11113> (DEV-11113) Arduino Pro Mini 328 - 3.3V/8MHz <https://www.sparkfun.com/products/11114> (DEV-11114) SparkFun OpenLog <https://www.sparkfun.com/products/13712> (DEV-13712) SparkFun MicroView - OLED Arduino Module <https://www.sparkfun.com/products/12923> (DEV-12923) SparkFun Digital Sandbox <https://www.sparkfun.com/products/12651> (DEV-12651) SparkFun PicoBoard <https://www.sparkfun.com/products/11888> (WIG-11888) Arduino Fio <https://www.sparkfun.com/products/10116> (DEV-10116) LilyPad Arduino 328 Main Board <https://www.sparkfun.com/products/13342> (DEV-13342) SparkFun RedStick <https://www.sparkfun.com/products/13741> (DEV-13741) LilyPad MP3 <https://www.sparkfun.com/products/11013> (DEV-11013) LilyPad Arduino SimpleSnap <https://www.sparkfun.com/products/10941> (DEV-10941) SparkFun Stepoko <https://www.sparkfun.com/products/13899> (ROB-13899) SparkFun Geiger Counter <https://www.sparkfun.com/products/11345> (SEN-11345) SparkFun EL Sequencer <https://www.sparkfun.com/products/12781> (COM-12781) Arduino Pro 328 - 5V/16MHz <https://www.sparkfun.com/products/10915> (DEV-10915) CryptoCape <https://www.sparkfun.com/products/12773> (DEV-12773) SparkFun IR Thermometer Evaluation Board - MLX90614 <https://www.sparkfun.com/products/10740> (SEN-10740) SparkFun RedBot Mainboard <https://www.sparkfun.com/products/12097> (ROB-12097) Arduino Pro 328 - 3.3V/8MHz <https://www.sparkfun.com/products/10914> (DEV-10914) SparkFun Block for Intel® Edison - Arduino <https://www.sparkfun.com/products/13036> (DEV-13036) SparkFun Simon Says - Surface Mount Soldering Kit <https://www.sparkfun.com/products/10935> (KIT-10935) SparkFun 7-Segment Serial Display - Red <https://www.sparkfun.com/products/11441> (COM-11441) SparkFun 7-Segment Serial Display - White <https://www.sparkfun.com/products/11629> (COM-11629) SparkFun 7-Segment Serial Display - Yellow <https://www.sparkfun.com/products/11443> (COM-11443) SparkFun 7-Segment Serial Display - Kelly Green <https://www.sparkfun.com/products/11440> (COM-11440) SparkFun 7-Segment Serial Display - Blue <https://www.sparkfun.com/products/11442> (COM-11442) SparkFun OpenSegment Serial Display - 20mm (Blue) <https://www.sparkfun.com/products/11647> (COM-11647) SparkFun OpenSegment Serial Display - 20mm (Green) <https://www.sparkfun.com/products/11646> (COM-11646) SparkFun OpenSegment Serial Display - 20mm (White) <https://www.sparkfun.com/products/11648> (COM-11648) SparkFun OpenSegment Serial Display - 20mm (Red) <https://www.sparkfun.com/products/11644> (COM-11644) SparkFun OpenSegment Serial Display - 20mm (Yellow) <https://www.sparkfun.com/products/11645> (COM-11645) SparkFun OpenSegment Shield <https://www.sparkfun.com/products/13190> (DEV-13190); PROD_ID: IC-09069
U4 = microbuilder:PCA9685: PCA9685 - 16 Channel 12-Bit I2C PWM Controller 5.0V tolerant 16 channel, 12-bit I2C PWM controller with 25mA per output (max. 400mA total) Digikey: 568-5931-1-ND
U$1-U$3 U$5-U$12 = ACS711_ameter:ACS711
U$4 U$13 = MCP3008:MCP3008
U$15 = MotherboardParts:ESC-FULL
Y2 = SparkFun-Clocks:CRYSTAL: Crystals (Generic) These are passive quartz crystals, which can be used as a clock source for a microcontroller. Crystal's are two-terminal devices. They require external "load" capacitors to generate an oscillating signal.